# EAGLE design sensor_battery (EAGLE 8.6.3)
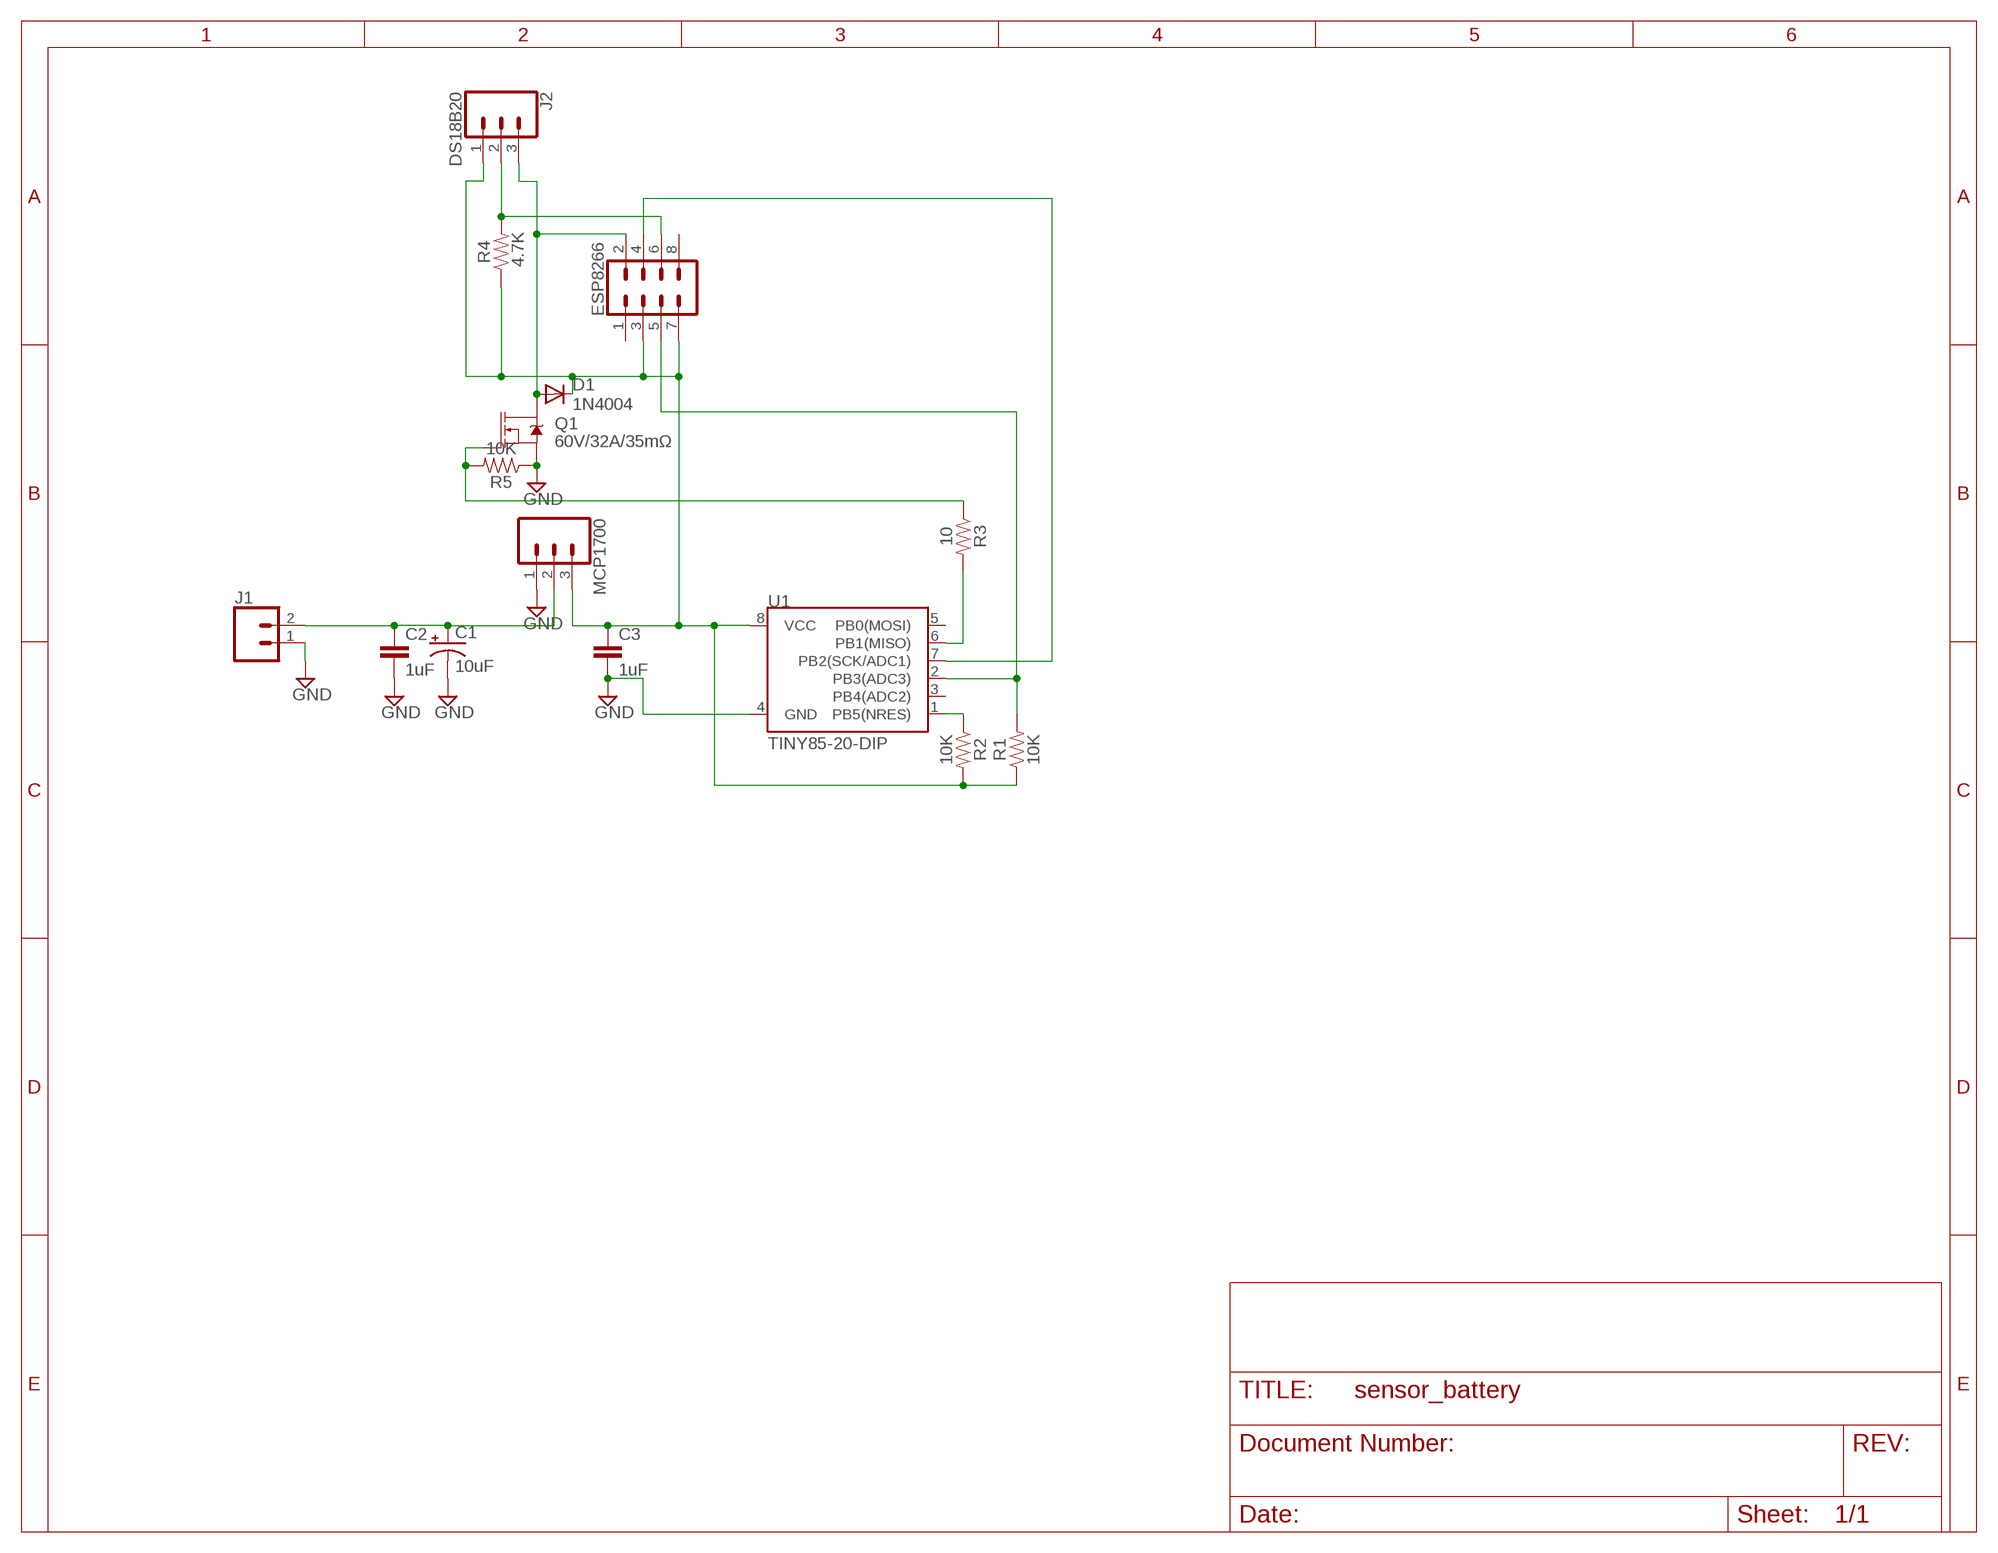
[diagram p0: schematic, sheet 1]

## Parts
C1  10uF  10UF-POLAR-RADIAL-2.5MM-25V-20%  [CPOL-RADIAL-2.5MM-5MM]
C2  1uF  C5/2.5  [C5B2.5]
C3  1uF  C5/2.5  [C5B2.5]
D1  1N4004  [DO41-10]
ESP8266  CONN_04X2  [2X4]
J1  CONN_02-JST-2-PTH-NO_SILK  [JST-2-PTH-NS]
J2  DS18B20  CONN_03JST-PTH  [JST-3-PTH]
MCP1700  CONN_03  [1X03]
Q1  60V/32A/35mΩ  MOSFET-NCH-FQP30N06L  [TO220V]
R1  10K  10OHM-HORIZ-1/4W-1%  [AXIAL-0.3]
R2  10K  10OHM-HORIZ-1/4W-1%  [AXIAL-0.3]
R3  10  10OHM-HORIZ-1/4W-1%  [AXIAL-0.3]
R4  4.7K  RESISTORAXIAL-0.3  [AXIAL-0.3]
R5  10K  10OHM-HORIZ-1/4W-1%  [AXIAL-0.3]
U1  TINY85-20-DIP  ATTINY45TINY85-20-DIP  [DIP08_MCU]

## Nets
3.3V: C3.1 D1.C ESP8266.3 ESP8266.7 J2.1 MCP1700.3 R1.P$1 R2.P$2 R4.P$1 U1.8(VCC)
5V: C1.1(+) C2.1 J1.2 MCP1700.2
ARST: R2.P$1 U1.1(PB5(NRES))
DSIG: ESP8266.4 U1.7(PB2(SCK/ADC1))
ERST: ESP8266.5 R1.P$2 U1.2(PB3(ADC3))
FGND: D1.A ESP8266.2 J2.3 Q1.2(D)
FSIG: Q1.1(G) R3.P$1 R5.P$2
FSIGFIRST: R3.P$2 U1.6(PB1(MISO))
GND: C1.2(-) C2.2 C3.2 J1.1 MCP1700.1 Q1.3(S) R5.P$1 U1.4(GND)
TDAT: ESP8266.6 J2.2 R4.P$2
Unconnected: ESP8266.1 ESP8266.8 U1.3(PB4(ADC2)) U1.5(PB0(MOSI))

## Library data of the parts
C1 = SparkFun-Capacitors:10UF-POLAR: 10.0µF polarized capacitors A capacitor is a passive two-terminal electrical component used to store electrical energy temporarily in an electric field.; PROD_ID: CAP-08440
C2 C3 = capacitor-wima:C: CAPACITOR naming: grid - package width
D1 = diode:1N4004: DIODE general purpose rectifier, 1 A
ESP8266 = SparkFun-Connectors:CONN_04X2: Multi connection point. Often used as Generic Header-pin footprint for 0.1 inch spaced/style header connections On any of the 0.1 inch spaced packages, you can populate with these: Break Away Headers - Straight <https://www.sparkfun.com/products/116> (PRT-00116) Break Away Male Headers - Right Angle <https://www.sparkfun.com/products/553> (PRT-00553) Female Headers <https://www.sparkfun.com/products/115> (PRT-00115) Break Away Headers - Machine Pin <https://www.sparkfun.com/products/117> (PRT-00117) Break Away Female Headers - Swiss Machine Pin <https://www.sparkfun.com/products/743> (PRT-00743)
J1 = SparkFun-Connectors:CONN_02: Multi connection point. Often used as Generic Header-pin footprint for 0.1 inch spaced/style header connections On any of the 0.1 inch spaced packages, you can populate with these: Break Away Headers - Straight <https://www.sparkfun.com/products/116> (PRT-00116) Break Away Male Headers - Right Angle <https://www.sparkfun.com/products/553> (PRT-00553) Female Headers <https://www.sparkfun.com/products/115> (PRT-00115) Break Away Headers - Machine Pin <https://www.sparkfun.com/products/117> (PRT-00117) Break Away Female Headers - Swiss Machine Pin <https://www.sparkfun.com/products/743> (PRT-00743) For SCREWTERMINALS and SPRING TERMINALS visit here: Screw Terimnals on SparkFun.com <https://www.sparkfun.com/search/results?term=Screw+Terminals> (5mm/3.5mm/2.54mm spacing) This device is also useful as a general connection point to wire up your design to another part of your project. Our various solder wires solder well into these plated through hole pads. Hook-Up Wire - Assortment (Stranded, 22 AWG) <https://www.sparkfun.com/products/11375> (PRT-11375) Hook-Up Wire - Assortment (Solid Core, 22 AWG) <https://www.sparkfun.com/products/11367> (PRT-11367) View the entire wire category on our website here <https://www.sparkfun.com/categories/141> Special notes: Molex polarized connector foot print use with: PRT-08233 with associated crimp pins and housings. 2.54_SCREWTERM for use with PRT-10571. 3.5mm Screw Terminal footprints for PRT-08084 5mm Screw Terminal footprints for use with PRT-08432
J2 = SparkFun-Connectors:CONN_03: Multi connection point. Often used as Generic Header-pin footprint for 0.1 inch spaced/style header connections On any of the 0.1 inch spaced packages, you can populate with these: Break Away Headers - Straight <https://www.sparkfun.com/products/116> (PRT-00116) Break Away Male Headers - Right Angle <https://www.sparkfun.com/products/553> (PRT-00553) Female Headers <https://www.sparkfun.com/products/115> (PRT-00115) Break Away Headers - Machine Pin <https://www.sparkfun.com/products/117> (PRT-00117) Break Away Female Headers - Swiss Machine Pin <https://www.sparkfun.com/products/743> (PRT-00743) Stackable Header - 3 Pin (Female, 0.1") <https://www.sparkfun.com/products/13875> (PRT-13875) For SCREWTERMINALS and SPRING TERMINALS visit here: Screw Terimnals on SparkFun.com <https://www.sparkfun.com/search/results?term=Screw+Terminals> (5mm/3.5mm/2.54mm spacing) This device is also useful as a general connection point to wire up your design to another part of your project. Our various solder wires solder well into these plated through hole pads. Hook-Up Wire - Assortment (Stranded, 22 AWG) <https://www.sparkfun.com/products/11375> (PRT-11375) Hook-Up Wire - Assortment (Solid Core, 22 AWG) <https://www.sparkfun.com/products/11367> (PRT-11367) View the entire wire category on our website here <https://www.sparkfun.com/categories/141> Special notes: Molex polarized connector foot print use with SKU : PRT-08232 with associated crimp pins and housings.; PROD_ID: WIRE-10037; SF_ID: PRT-09915
MCP1700 = SparkFun-Connectors:CONN_03: Multi connection point. Often used as Generic Header-pin footprint for 0.1 inch spaced/style header connections On any of the 0.1 inch spaced packages, you can populate with these: Break Away Headers - Straight <https://www.sparkfun.com/products/116> (PRT-00116) Break Away Male Headers - Right Angle <https://www.sparkfun.com/products/553> (PRT-00553) Female Headers <https://www.sparkfun.com/products/115> (PRT-00115) Break Away Headers - Machine Pin <https://www.sparkfun.com/products/117> (PRT-00117) Break Away Female Headers - Swiss Machine Pin <https://www.sparkfun.com/products/743> (PRT-00743) Stackable Header - 3 Pin (Female, 0.1") <https://www.sparkfun.com/products/13875> (PRT-13875) For SCREWTERMINALS and SPRING TERMINALS visit here: Screw Terimnals on SparkFun.com <https://www.sparkfun.com/search/results?term=Screw+Terminals> (5mm/3.5mm/2.54mm spacing) This device is also useful as a general connection point to wire up your design to another part of your project. Our various solder wires solder well into these plated through hole pads. Hook-Up Wire - Assortment (Stranded, 22 AWG) <https://www.sparkfun.com/products/11375> (PRT-11375) Hook-Up Wire - Assortment (Solid Core, 22 AWG) <https://www.sparkfun.com/products/11367> (PRT-11367) View the entire wire category on our website here <https://www.sparkfun.com/categories/141> Special notes: Molex polarized connector foot print use with SKU : PRT-08232 with associated crimp pins and housings.; PROD_ID: XXX-00000; VALUE: 455-1750-1-ND
Q1 = SparkFun-DiscreteSemi:MOSFET-NCH: N-channel MOSFETs Voltage controlled devices that allow control of high current outputs. SparkFun Products: SparkFun OpenScale <https://www.sparkfun.com/products/13261> SparkFun Digital Sandbox <https://www.sparkfun.com/products/12651> SparkFun Monster Moto Shield <https://www.sparkfun.com/products/10182> SparkFun MOSFET Power Controller <https://www.sparkfun.com/products/11214>; PROD_ID: TRANS-10060
R1 R2 R5 = SparkFun-Resistors:10OHM: 10Ω resistor A resistor is a passive two-terminal electrical component that implements electrical resistance as a circuit element. Resistors act to reduce current flow, and, at the same time, act to lower voltage levels within circuits. - Wikipedia; PROD_ID: RES-12180; VALUE: 10
R3 = SparkFun-Resistors:10OHM: 10Ω resistor A resistor is a passive two-terminal electrical component that implements electrical resistance as a circuit element. Resistors act to reduce current flow, and, at the same time, act to lower voltage levels within circuits. - Wikipedia; PROD_ID: RES-12180
R4 = SparkFun-Resistors:RESISTOR: Generic Resistor Package
U1 = SparkFun-Retired:ATTINY45: Atmel 8-pin 2/4/8kB flash uC Retired; PROD_ID: IC-09445

## Board
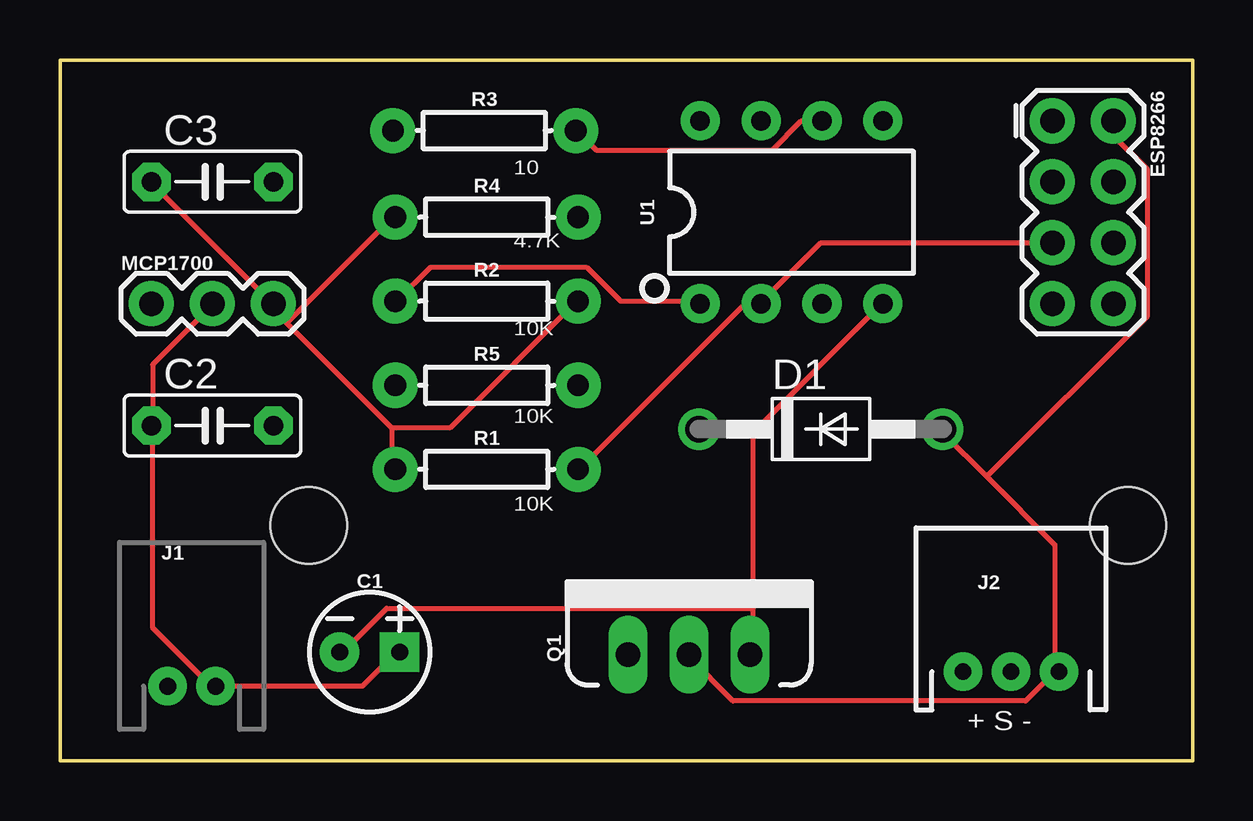
[diagram p1: board, top side]
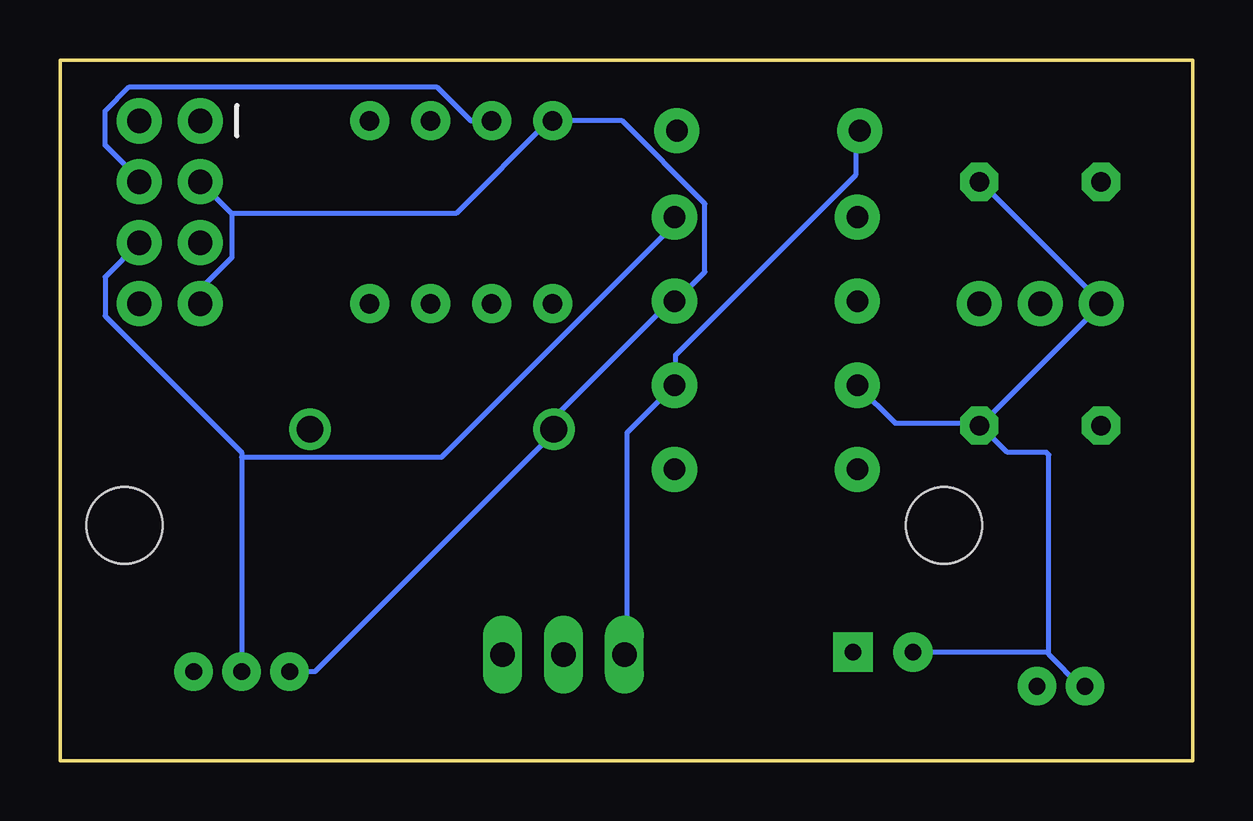
[diagram p2: board, bottom side, seen from below]

Size 47.19 x 29.21 mm. Coordinates in mm from the lower left corner, seen from the top.
Outline: 0,0 0,29.21 47.19,29.21 47.19,0 0,0
Copper layers (1*16): Top 0.035mm / dielectric 1.5mm / Bottom 0.035mm
Design rules "SparkFun": minimum track width 8mil, minimum drill 20mil, track to track 8mil, track to pad 8mil, pad to pad 8mil, via to via 8mil, smd to smd 8mil, copper to edge 8mil, drill to drill 8mil, minimum pad ring 12mil, minimum via ring 10mil, stop-mask expansion 4mil, vias tented up to drill 20mil, thermal gap 10mil
Holes 3.17 mm at 44.5,9.8 10.36,9.8

### Footprints (pad centres in the part's own frame; a part is rotated, then mirrored left to right if it is on the bottom)
CPOL-RADIAL-2.5MM-5MM = drill 0.7 pad 1.651 square: 1 1.25,0 | drill 0.7 pad 1.651: 2 -1.25,0
C5B2.5 = drill 0.813 pad 1.6 octagon: 1 -2.54,0; 2 2.54,0
DO41-10 = drill 1.118: A 5.08,0; C -5.08,0
2X4 = drill 1.016 pad 1.88: 1 -3.81,-1.27; 2 -3.81,1.27; 3 -1.27,-1.27; 4 -1.27,1.27; 5 1.27,-1.27; 6 1.27,1.27; 7 3.81,-1.27; 8 3.81,1.27
JST-2-PTH-NS = drill 0.7 pad 1.6: 1 -1,0; 2 1,0
JST-3-PTH = drill 0.7 pad 1.6: 1 -2,0; 2 0,0; 3 2,0
1X03 = drill 1.016 pad 1.88: 1 0,0; 2 2.54,0; 3 5.08,0
TO220V = drill 1.016 long: 1 -2.54,0; 2 0,0; 3 2.54,0
AXIAL-0.3 = drill 0.9 pad 1.88: P$1 -3.81,0; P$2 3.81,0
DIP08_MCU = drill 0.813 pad 1.626: 1 -3.81,-3.81; 2 -1.27,-3.81; 3 1.27,-3.81; 4 3.81,-3.81; 5 3.81,3.81; 6 1.27,3.81; 7 -1.27,3.81; 8 -3.81,3.81

### Placement (x,y rotation side)
C1  12.9,4.52 0 top
C2  6.35,13.97 0 top
C3  6.35,24.13 0 top
D1  31.7,13.82 0 top
ESP8266  42.62,22.86 270 top
J1  5.49,3.1 0 top
J2  39.62,3.71 0 top
MCP1700  3.81,19.05 0 top
Q1  26.21,4.42 0 top
R1  17.78,12.14 0 top
R2  17.78,19.15 0 top
R3  17.68,26.26 0 top
R4  17.78,22.66 0 top
R5  17.78,15.65 0 top
U1  30.48,22.86 0 top

### Tracks (layer width: path | path; a pad name or v marks a point on that pad's centre or on a via)
3.3V
  Top 0.203: C3.1 3.86,24.03 8.74,19.15 MCP1700.3 | 13.82,13.87 13.82,12.24 R1.P$1 | 9.35,18.34 8.74,18.95 MCP1700.3 | 9.35,18.34 13.82,13.87 | 9.35,18.34 9.55,18.34 13.82,22.61 R4.P$1 | 9.35,18.34 MCP1700.3 | 13.82,13.87 16.26,13.87 21.54,19.15 R2.P$2
  Bottom 0.203: J2.1 36.58,3.71 26.62,13.66 D1.C 26.62,14.27 21.74,19.15 R2.P$2 21.54,19.15 20.32,20.37 20.32,23.22 23.77,26.67 U1.8 26.82,26.67 30.68,22.81 40.03,22.81 | 40.03,22.81 40.03,20.98 41.25,19.76 41.25,19.15 ESP8266.7 | ESP8266.3 40.03,22.81
5V
  Top 0.203: MCP1700.2 6.3,18.95 3.86,16.51 3.86,14.07 C2.1 3.86,13.87 3.86,5.54 6.3,3.1 J1.2 12.6,3.1 14.02,4.52 C1.1
ARST
  Top 0.203: U1.1 26.62,19.15 23.37,19.15 21.95,20.57 15.44,20.57 14.02,19.15 R2.P$1
DSIG
  Bottom 0.203: U1.7 30.07,26.67 31.5,28.09 44.3,28.09 45.31,27.08 45.31,25.65 43.89,24.23 ESP8266.4
ERST
  Top 0.203: R1.P$2 21.74,12.24 28.45,18.95 29.06,18.95 U1.2 29.26,19.15 31.7,21.59 ESP8266.5
FGND
  Top 0.203: 41.45,3.71 41.45,8.99 38.61,11.84 | 38.61,11.84 36.78,13.66 D1.A | 41.45,3.71 40.23,2.49 28.04,2.49 26.21,4.32 Q1.2 | 41.45,3.71 J2.3 | ESP8266.2 43.89,26.06 45.31,24.64 45.31,18.54 38.61,11.84
FSIG
  Bottom 0.203: Q1.1 23.57,4.52 23.57,13.66 R5.P$2 21.54,15.7 21.54,16.92 14.02,24.43 14.02,26.26 R3.P$1
FSIGFIRST
  Top 0.203: U1.6 30.89,26.67 29.67,25.45 22.35,25.45 21.54,26.26 R3.P$2
GND
  Top 0.203: 28.85,6.35 28.85,13.66 34.14,18.95 U1.4 | 28.85,6.35 28.85,4.52 Q1.3 | 28.85,6.35 13.61,6.35 11.79,4.52 C1.2
  Bottom 0.203: 5.99,4.42 6.1,4.52 C1.2 | 5.99,4.42 4.67,3.1 J1.1 | 8.94,14.07 12.4,14.07 R5.P$1 | 8.94,14.07 C2.2 | C3.2 8.74,24.03 3.86,19.15 MCP1700.1 3.86,18.95 8.74,14.07 C2.2 | 8.94,13.87 C2.2 | 5.99,4.42 5.99,12.75 6.1,12.85 7.72,12.85 8.94,14.07
TDAT
  Bottom 0.203: 39.62,12.65 39.62,12.85 45.31,18.54 45.31,20.17 ESP8266.6 | 39.62,12.65 J2.2 | 39.62,12.65 31.29,12.65 21.74,22.2 21.74,22.61 R4.P$2

### Text on the board
tPlace: 10 | 4.7K | 10K | 10K | 10K | + S -